# Altium schematic sheet Sheet1.SchDoc
size A4
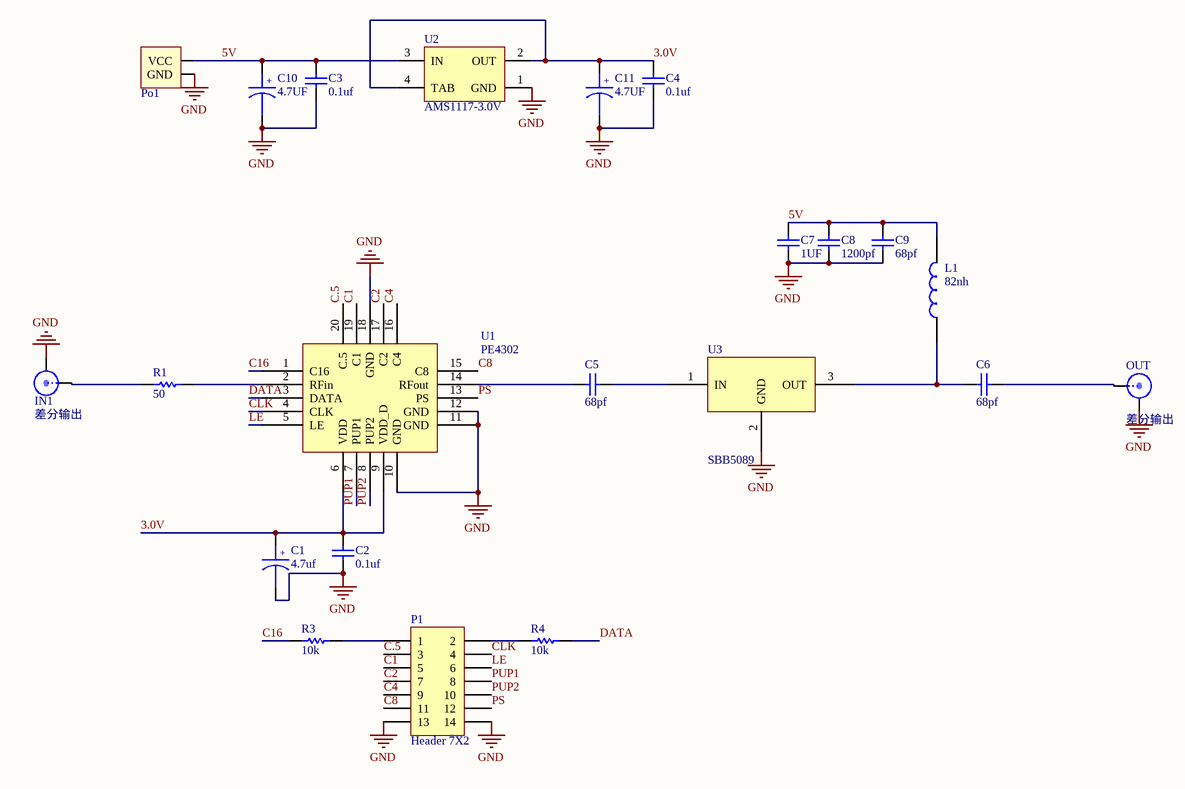
[diagram p0: Sheet1.SchDoc]

## Parts
C1  4.7uf  [7343-31 TYPE D]
C2  0.1uf  [0603C]
C3  0.1uf  [0805]
C4  0.1uf  [0805]
C5  68pf  [0805]
C6  68pf  [0805]
C7  1UF  [0805]
C8  1200pf  [0805]
C9  68pf  [0805]
C10  4.7UF  [7343-31 TYPE D]
C11  4.7UF  [7343-31 TYPE D]
IN1  差分输出  [SMA-LYING]
L1  82nh  [0805]
OUT  差分输出  [SMA-LYING]
P1  Header 7X2  [HDR2X7]
Po1  Power_2Port  [Power_S_2Port]  (value not drawn)
R1  50  [0805]
R3  10k  [0603R]
R4  10k  [0603R]
U1  PE4302  [LC-QFN-20_4x4x05P]
U2  AMS1117-3.0V  [SOT223]
U3  SBB5089  [SOT-89]

## Nets
GND: C1.2 C2.1 C3.1 C4.1 C7.2 C8.2 C9.2 C10.2 C11.2 IN1.1 OUT.1 P1.13 P1.14 Po1.2(GND) U1.10(GND) U1.11(GND) U1.12(GND) U1.18(GND) U2.1(GND) U3.2(GND)
3.0V: C1.1 C2.2 C4.2 C11.1 U1.6(VDD) U1.9(VDD_D) U2.2(OUT) U2.4(TAB)
5V: C3.2 C7.1 C8.1 C9.1 C10.1 L1.2 Po1.1(VCC) U2.3(IN)
C1: P1.5 U1.19(C1)
C2: P1.7 U1.17(C2)
C4: P1.9 U1.16(C4)
C8: P1.11 U1.15(C8)
C16: R3.1 U1.1(C16)
C.5: P1.3 U1.20(C.5)
CLK: P1.4 U1.4(CLK)
DATA: R4.2 U1.3(DATA)
LE: P1.6 U1.5(LE)
PS: P1.12 U1.13(PS)
PUP1: P1.8 U1.7(PUP1)
PUP2: P1.10 U1.8(PUP2)
NetC5_1: C5.1 U3.1(IN)
NetC5_2: C5.2 U1.14(RFout)
NetC6_1: C6.1 OUT.0
NetC6_2: C6.2 L1.1 U3.3(OUT)
NetIN1_0: IN1.0 R1.1
NetP1_1: P1.1 R3.2
NetP1_2: P1.2 R4.1
NetR1_2: R1.2 U1.2(RFin)

## Notes on the sheet
- (in symbol Tantalium Cap) +

## Library data of the parts
C1 C10 C11 = Tantalium Cap
C2-C9 = Cap
IN1 OUT = SMA
L1 = Inductor
P1 = Header 7X2: Header, 7-Pin, Dual row; LatestRevisionDate: 17-Jul-2002; LatestRevisionNote: Re-released for DXP Platform.; Publisher: Altium Limited
R1 R3 R4 = Res